# Altium schematic sheet Motor Control.SchDoc
size A4
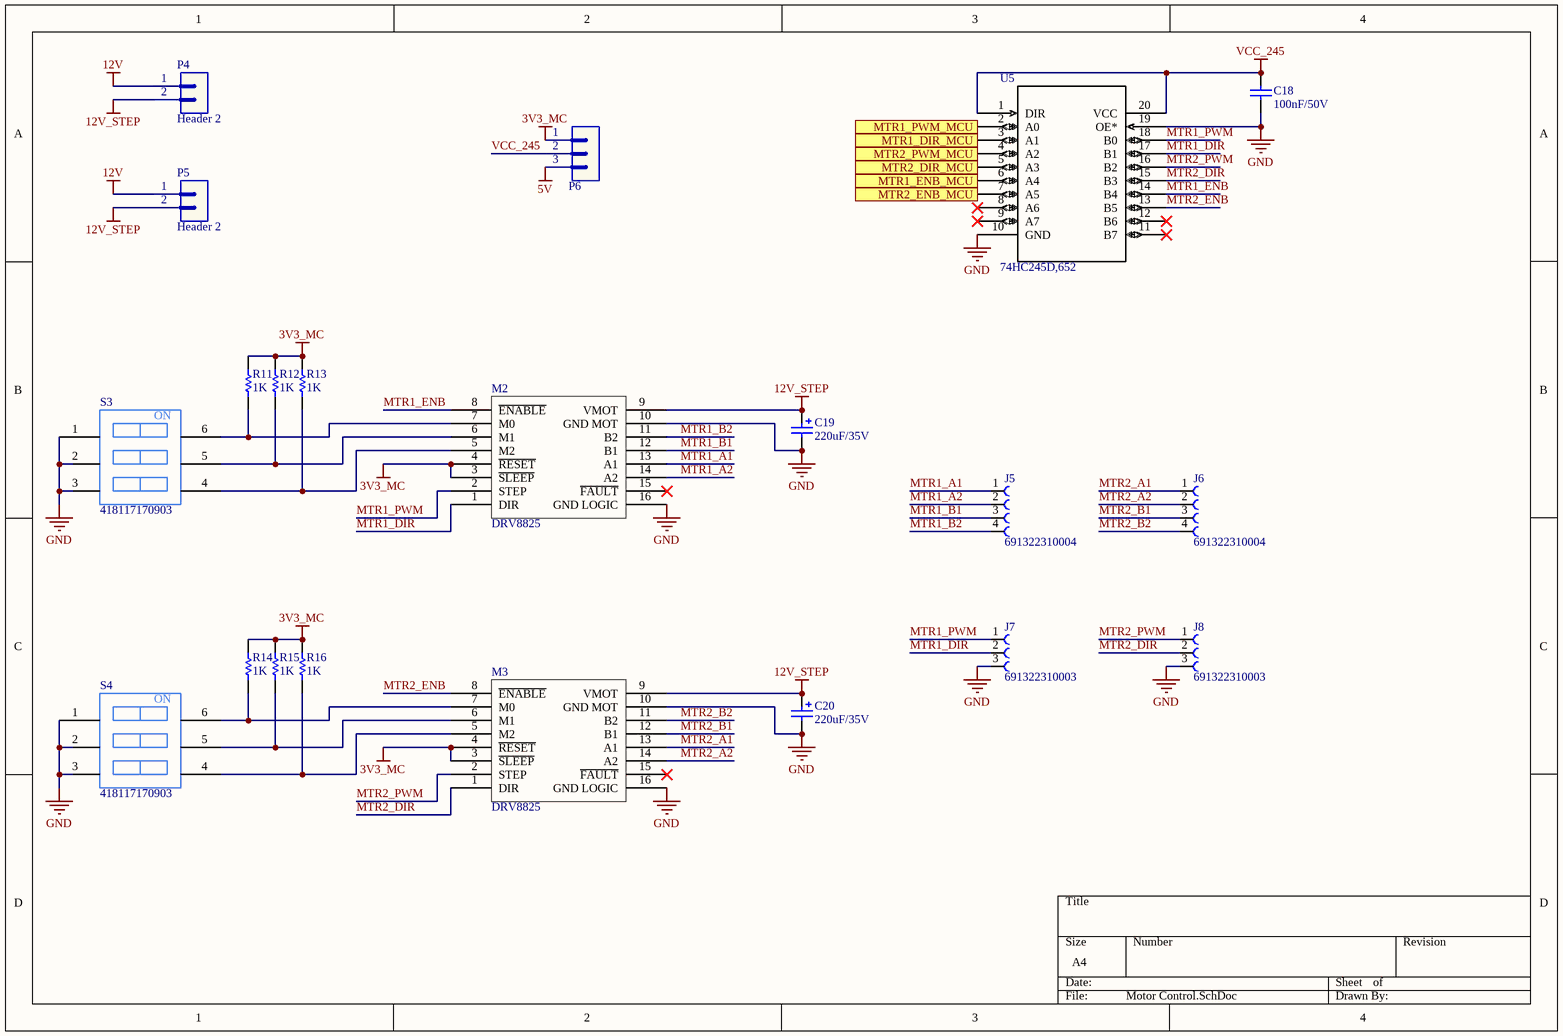
[diagram p0: Motor Control.SchDoc]

## Parts
C18  value 100nF/50V  [CAP-SM-0805]  (hidden comment: Cap-100nF-50V-0805)
C19  value 220uF/35V  [CAP-SM-AL-SIZE-F-D8L10]  (hidden comment: Cap-Al-220uF-35V-D8L10)
C20  value 220uF/35V  [CAP-SM-AL-SIZE-F-D8L10]  (hidden comment: Cap-Al-220uF-35V-D8L10)
J5  691322310004  [691322310004]
J6  691322310004  [691322310004]
J7  691322310003  [691322310003]
J8  691322310003  [691322310003]
M2  DRV8825  [DRV8825]
M3  DRV8825  [DRV8825]
P4  Header 2  [JP2]
P5  Header 2  [JP2]
P6  Header 3  [JP3]  (value not drawn)
R11  value 1K  [RES-SM-0805]  (hidden comment: Res-1K-0805)
R12  value 1K  [RES-SM-0805]  (hidden comment: Res-1K-0805)
R13  value 1K  [RES-SM-0805]  (hidden comment: Res-1K-0805)
R14  value 1K  [RES-SM-0805]  (hidden comment: Res-1K-0805)
R15  value 1K  [RES-SM-0805]  (hidden comment: Res-1K-0805)
R16  value 1K  [RES-SM-0805]  (hidden comment: Res-1K-0805)
S3  418117170903  [418117170903]
S4  418117170903  [418117170903]
U5  74HC245D,652  [74HC245D-652]

## Ports
MTR1_DIR_MCU (in), MTR1_ENB_MCU (in), MTR1_PWM_MCU (in), MTR2_DIR_MCU (in), MTR2_ENB_MCU (in), MTR2_PWM_MCU (in)

## Nets
3V3_MC: M2.3(~{SLEEP}) M2.4(~{RESET}) M3.3(~{SLEEP}) M3.4(~{RESET}) P6.1 R11.2 R12.2 R13.2 R14.2 R15.2 R16.2
5V: P6.3
12V: P4.1 P5.1
12V_STEP: C19.1 C20.1 M2.9(VMOT) M3.9(VMOT) P4.2 P5.2
GND: C18.1 C19.2 C20.2 J7.3 J8.3 M2.10(GND_MOT) M2.16(GND_LOGIC) M3.10(GND_MOT) M3.16(GND_LOGIC) U5.10(GND) U5.19(OE*)
VCC_245: C18.2 P6.2 U5.1(DIR) U5.20(VCC)
MTR1_A1: J5.1 M2.13(A1)
MTR1_A2: J5.2 M2.14(A2)
MTR1_B1: J5.3 M2.12(B1)
MTR1_B2: J5.4 M2.11(B2)
MTR1_DIR: J7.2 M2.1(DIR) U5.17(B1)
MTR1_DIR_MCU: U5.3(A1) ; port MTR1_DIR_MCU
MTR1_ENB: M2.8(~{ENABLE}) U5.14(B4)
MTR1_ENB_MCU: U5.6(A4) ; port MTR1_ENB_MCU
MTR1_PWM: J7.1 M2.2(STEP) U5.18(B0)
MTR1_PWM_MCU: U5.2(A0) ; port MTR1_PWM_MCU
MTR2_A1: J6.1 M3.13(A1)
MTR2_A2: J6.2 M3.14(A2)
MTR2_B1: J6.3 M3.12(B1)
MTR2_B2: J6.4 M3.11(B2)
MTR2_DIR: J8.2 M3.1(DIR) U5.15(B3)
MTR2_DIR_MCU: U5.5(A3) ; port MTR2_DIR_MCU
MTR2_ENB: M3.8(~{ENABLE}) U5.13(B5)
MTR2_ENB_MCU: U5.7(A5) ; port MTR2_ENB_MCU
MTR2_PWM: J8.1 M3.2(STEP) U5.16(B2)
MTR2_PWM_MCU: U5.4(A2) ; port MTR2_PWM_MCU
NetM2_5: M2.5(M2) R13.1
NetM2_6: M2.6(M1) R12.1
NetM2_7: M2.7(M0) R11.1
NetM3_5: M3.5(M2) R16.1
NetM3_6: M3.6(M1) R15.1
NetM3_7: M3.7(M0) R14.1

Not connected (* = marked no-connect by the designer): M2 15(~{FAULT})*; M3 15(~{FAULT})*; S3 1 2 3 4 5 6; S4 1 2 3 4 5 6; U5 8(A6)* 9(A7)* 11(B7)* 12(B6)*

## Notes on the sheet
- (in symbol 418117170903) ON

## Library data of the parts
C18 = Cap-100nF-50V-0805: CAP CER 0.1UF 50V Y5V 0805; Manufacturer: Samsung Electro-Mechanics; Manufacturer Part Number: CL21F104ZBCNNNC; Local Supplier: thegioiic; Local Supplier Link: https://thegioiic.com/products/tu-100nf-0-1uf-50v-0805; Supplier 1: Digikey; Supplier 1 Part Number: 1276-1007-1-ND; Supplier 1 Link: https://www.digikey.com/product-detail/en/samsung-electro-mechanics/CL21F104ZBCNNNC/1276-1007-1-ND/3889093
C19 C20 = Cap-Al-220uF-35V-D8L10: CAP ALUM 220UF 20% 35V SMD; Manufacturer: Nichicon; Manufacturer Part Number: UWT1V221MNL1GS; Local Supplier: thegioiic; Local Supplier Link: https://thegioiic.com/products/tu-nhom-smd-220uf-35v-d8l10; Supplier 1: Digikey; Supplier 1 Link: https://www.digikey.com/product-detail/en/nichicon/UWT1V221MNL1GS/493-2205-2-ND/589946; Supplier 1 Part Number: 493-2205-2-ND
J5 J6 = 691322310004: 4 Position Terminal Block Header, Male Pins, Shrouded (4 Side) 0.150 (3.81mm) 90Â°, Right Angle Through Hole; MF: Wurth Electronics; Package: None; DigiKey-Purchase-URL: https://snapeda.com/shop?store=DigiKey&id=1195122; Value: *; MP: 691322310004; Availability: Unavailable; SnapEDA_Link: https://www.snapeda.com/parts/691322310004/Wurth%20Electronics%20Inc./view-part/1195122/?ref=snap; Price: None
J7 J8 = 691322310003: 3 Position Terminal Block Header, Male Pins, Shrouded _4 Side_ 0.150 _3.81mm_ 90Â°, Right Angle Through Hole; MF: Wurth Electronics; Availability: Unavailable; SnapEDA_Link: https://www.snapeda.com/parts/691322310003/Wurth%20Electronics%20Inc./view-part/1195121/?ref=snap; MP: 691322310003; Price: None; Package: None; DigiKey-Purchase-URL: https://snapeda.com/shop?store=DigiKey&id=1195121; Value: *
P4 P5 = Header 2: Header, 2-Pin; LatestRevisionDate: 17-Jul-2002; LatestRevisionNote: Re-released for DXP Platform.; Publisher: Altium Limited
P6 = Header 3: Header, 3-Pin; LatestRevisionDate: 17-Jul-2002; LatestRevisionNote: Re-released for DXP Platform.; Publisher: Altium Limited
R11-R16 = Res-1K-0805: RES 1K OHM 1% 1/4W 0805; Manufacturer: Stackpole Electronics Inc; Manufacturer Part Number: RNCP0805FTD1K00; Local Supplier: thegioiic; Local Supplier Link: https://thegioiic.com/products/dien-tro-1k-ohm-0805-5; Supplier 1: Digikey; Supplier 1 Link: https://www.digikey.com/product-detail/en/stackpole-electronics-inc/RNCP0805FTD1K00/RNCP0805FTD1K00CT-ND/2240568; Supplier 1 Part Number: RNCP0805FTD1K00CT-ND
U5 = 74HC245D,652: Vendor: Nexperia; SourceLibrary: Nexperia_2018-05-2018; Manufacturer_Part_Number: 74HC245D,652; Copyright: Copyright (C) 2016 Accelerated Designs. All rights reserved; RefDes: RefDes; Type: DEV
M2 M3 = DRV8825: Local Supplier: NShop; Local Supplier Link: https://nshopvn.com/product/mach-dieu-khien-dong-co-buoc-drv8825/?gclid=Cj0KCQjwrIf3BRD1ARIsAMuugNvhHaPvOoXKOe7yuk1AcgXaHXv0JlSPYKOD4P10-tIEuNTPRK5zkgEaAjhjEALw_wcB; Local Supplier Part Number: *; Manufacturer: *; Manufacturer Part Number: *
S3 S4 = 418117170903: Manufacturer Part Number: *; Local Supplier Link: https://www.thegioiic.com/products/cong-tac-3-bit-dip-switch-xuyen-lo-2-54mm-mau-do; Local Supplier Part Number: *; Manufacturer: *; Local Supplier: thegioiic